# Altium schematic sheet Communication_Part1.SchDoc
size A4
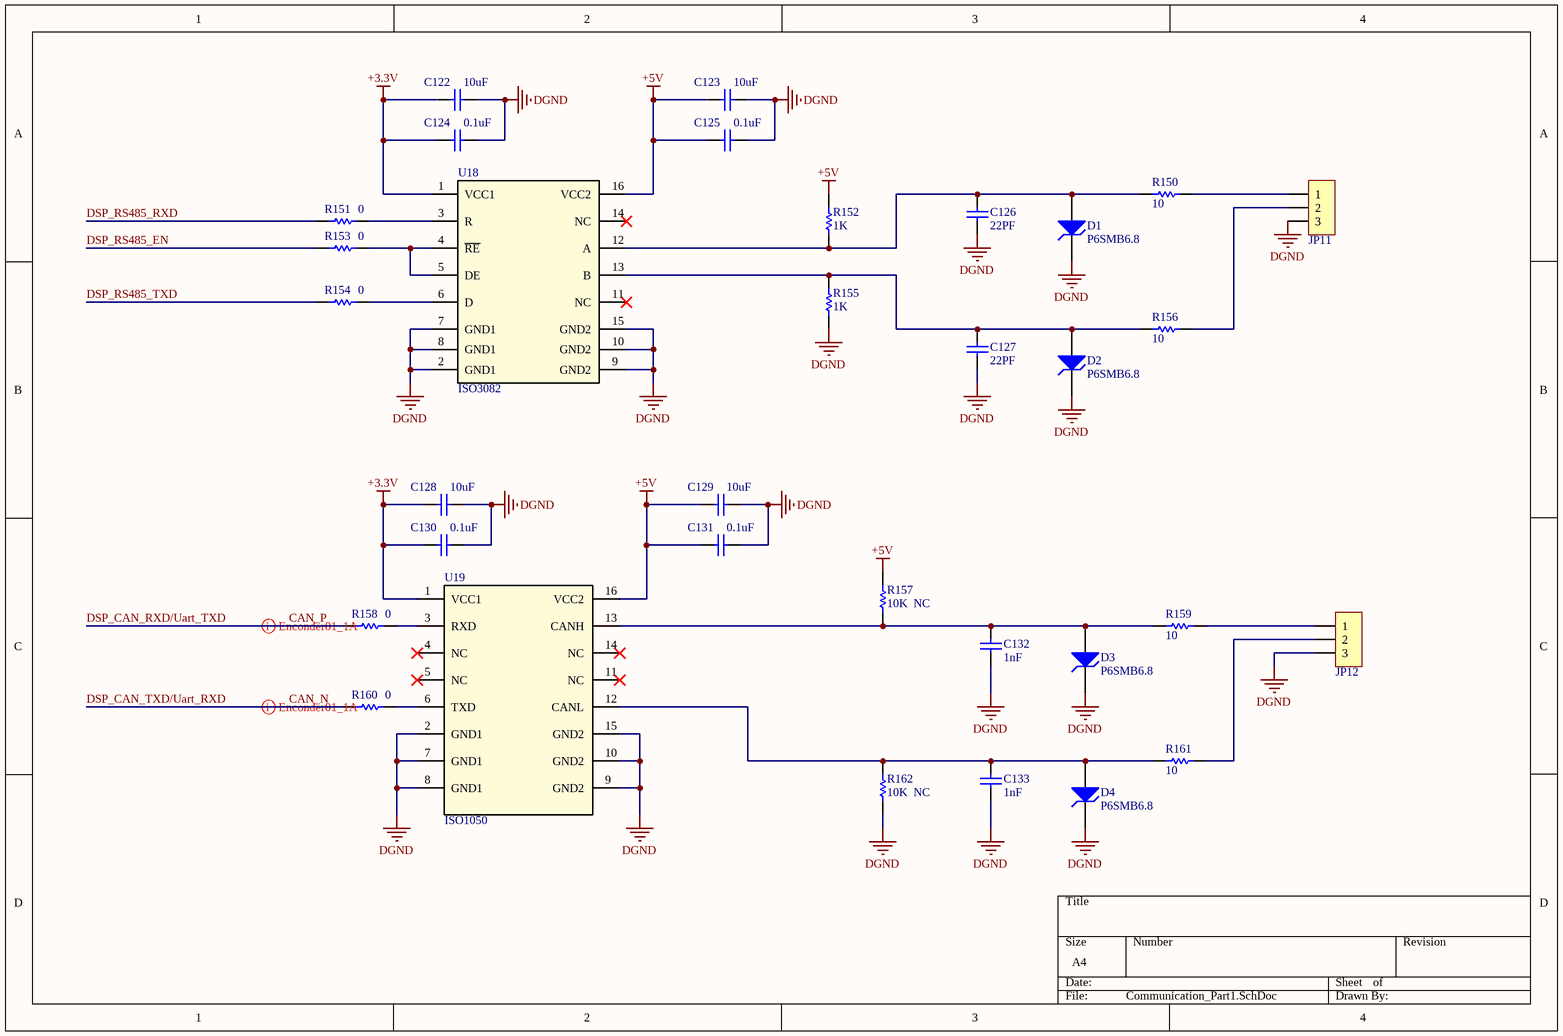
[diagram p0: Communication_Part1.SchDoc]

## Parts
C122  value 10uF  [1608[0603]]  (hidden comment: Cap)
C123  value 10uF  [1608[0603]]  (hidden comment: Cap)
C124  value 0.1uF  [1608[0603]]  (hidden comment: Cap)
C125  value 0.1uF  [1608[0603]]  (hidden comment: Cap)
C126  value 22PF  [1608[0603]]  (hidden comment: Cap)
C127  value 22PF  [1608[0603]]  (hidden comment: Cap)
C128  value 10uF  [1608[0603]]  (hidden comment: Cap)
C129  value 10uF  [1608[0603]]  (hidden comment: Cap)
C130  value 0.1uF  [1608[0603]]  (hidden comment: Cap)
C131  value 0.1uF  [1608[0603]]  (hidden comment: Cap)
C132  value 1nF  [1608[0603]]  (hidden comment: Cap)
C133  value 1nF  [1608[0603]]  (hidden comment: Cap)
D1  P6SMB6.8  [DIODE_SMC]
D2  P6SMB6.8  [DIODE_SMC]
D3  P6SMB6.8  [DIODE_SMC]
D4  P6SMB6.8  [DIODE_SMC]
JP11  HDR-1X3  [ZH1.5-WI-3P]  (value not drawn)
JP12  HDR-1X3  [ZH1.5-WI-3P]  (value not drawn)
R150  value 10  [1608[0603]]  (hidden comment: Res1)
R151  value 0  [1608[0603]]  (hidden comment: Res1)
R152  value 1K  [1608[0603]]  (hidden comment: Res1)
R153  value 0  [1608[0603]]  (hidden comment: Res1)
R154  value 0  [1608[0603]]  (hidden comment: Res1)
R155  value 1K  [1608[0603]]  (hidden comment: Res1)
R156  value 10  [1608[0603]]  (hidden comment: Res1)
R157  value 10K  NC  [1608[0603]]  (hidden comment: Res1)
R158  value 0  [1608[0603]]  (hidden comment: Res1)
R159  value 10  [1608[0603]]  (hidden comment: Res1)
R160  value 0  [1608[0603]]  (hidden comment: Res1)
R161  value 10  [1608[0603]]  (hidden comment: Res1)
R162  value 10K  NC  [1608[0603]]  (hidden comment: Res1)
U18  ISO3082  [ISO3082_SOIC]
U19  ISO1050  [ISO1050_SOIC]

## Nets
+3.3V: C122.2 C124.2 C128.2 C130.2 U18.1(VCC1) U19.1(VCC1)
+5V: C123.2 C125.2 C129.2 C131.2 R152.2 R157.2 U18.16(VCC2) U19.16(VCC2)
DGND: C122.1 C123.1 C124.1 C125.1 C126.2 C127.2 C128.1 C129.1 C130.1 C131.1 C132.2 C133.2 D1.1(K) D2.1(K) D3.1(K) D4.1(K) JP11.3 JP12.3 R155.1 R162.1 U18.2(GND1) U18.7(GND1) U18.8(GND1) U18.9(GND2) U18.10(GND2) U18.15(GND2) U19.2(GND1) U19.7(GND1) U19.8(GND1) U19.9(GND2) U19.10(GND2) U19.15(GND2)
CAN_N: R160.1  [also labelled DSP_CAN_TXD/Uart_RXD]
CAN_P: R158.1  [also labelled DSP_CAN_RXD/Uart_TXD]
DSP_RS485_EN: R153.1
DSP_RS485_RXD: R151.1
DSP_RS485_TXD: R154.1
NetC126_1: C126.1 D1.2(A) R150.2 R152.1 U18.12(A)
NetC127_1: C127.1 D2.2(A) R155.2 R156.2 U18.13(B)
NetC132_1: C132.1 D3.2(A) R157.1 R159.2 U19.13(CANH)
NetC133_1: C133.1 D4.2(A) R161.2 R162.2 U19.12(CANL)
NetJP11_1: JP11.1 R150.1
NetJP11_2: JP11.2 R156.1
NetJP12_1: JP12.1 R159.1
NetJP12_2: JP12.2 R161.1
NetR151_2: R151.2 U18.3(R)
NetR153_2: R153.2 U18.4(~{RE}) U18.5(DE)
NetR154_2: R154.2 U18.6(D)
NetR158_2: R158.2 U19.3(RXD)
NetR160_2: R160.2 U19.6(TXD)

Not connected (* = marked no-connect by the designer): U18 11(NC)* 14(NC)*; U19 4(NC)* 5(NC)* 11(NC)* 14(NC)*

## Layout directives
differential pair: CAN_N, CAN_P

## Library data of the parts
C122-C133 = Cap: Capacitor; Published: 8-Jun-2000; LatestRevisionDate: 17-Jul-2002; LatestRevisionNote: Re-released for DXP Platform.; PackageReference: RAD-0.3; Publisher: Altium Limited; PackageDescription: Radial Cap, Thru-Hole; 2 Leads; 0.3 in Pin Spacing
D1-D4 = MMSZ56T1: Surface Mount Silicon Zener Diode; Published: 29-Sep-2000; LatestRevisionDate: 19-Mar-2004; LatestRevisionNote: Silkscreen size reduced; PCB footprint pad transposed.; PackageVersion: 1988; PackageReference: 425; Publisher: Altium Limited; PackageDescription: SOD-123; 2 Leads; Body 2.7 x 1.6 mm, (LxW); ComponentLink1Description: Manufacturer Link; ComponentLink1URL: http://www.onsemi.com/site/products/landing?taxonomyID=194; ComponentLink2Description: Datasheet; ComponentLink2URL: http://www.onsemi.com/pub/Collateral/MMSZ2V4T1-D.PDF
JP11 JP12 = Header 3: 3P接插件; 版权归属: 源创客; BOM名称: 3P接插件; 学习资源: www.ooocke.com
R150-R162 = Res1: Resistor; Published: 8-Jun-2000; LatestRevisionDate: 17-Jul-2002; LatestRevisionNote: Re-released for DXP Platform.; PackageReference: AXIAL-0.3; Publisher: Altium Limited; PackageDescription: Axial Device, Thru-Hole; 2 Leads; 0.3 in Pin Spacing
U18 = ISO3082: Manufacturer: Texas Instruments; Manufacturer_Part_Number: iso3082_dw_16; INDUSTRY_STD_PKG_TYPE: SOIC; FAMILY_NAME: ISOLATOR; PIN_COUNT: 16; PACKAGE_DESIGNATOR: DW; Datasheet_URL: http://www.ti.com/lit/gpn/ISO3082; GENERIC_PART_NUMBER: ISO3082; Vendor: Texas Instruments; Value: Value; Type: Type; RefDes: RefDes
U19 = ISO1050: Manufacturer: Texas Instruments; Manufacturer_Part_Number: iso1050_dw_16; INDUSTRY_STD_PKG_TYPE: SOIC; FAMILY_NAME: ISOLATOR; PIN_COUNT: 16; PACKAGE_DESIGNATOR: DW; Datasheet_URL: http://www.ti.com/lit/gpn/ISO1050; GENERIC_PART_NUMBER: ISO1050; Vendor: Texas Instruments; Value: Value; Type: Type; RefDes: RefDes